# Altium schematic sheet LP_ECG_Main-X01.SchDoc: MCU + BLE
size Letter; Author: C. DEMOLDER; CompanyName: GTBID; DrawnBy: C. DEMOLDER; Engineer: C. DEMOLDER; Organization: GEORGIA TECH; Address1: NORTH AVE NW; Address2: ATLANTA, GA, 30332; DocumentNumber: P001; Revision: X01; SheetNumber: 1; SheetTotal: 4
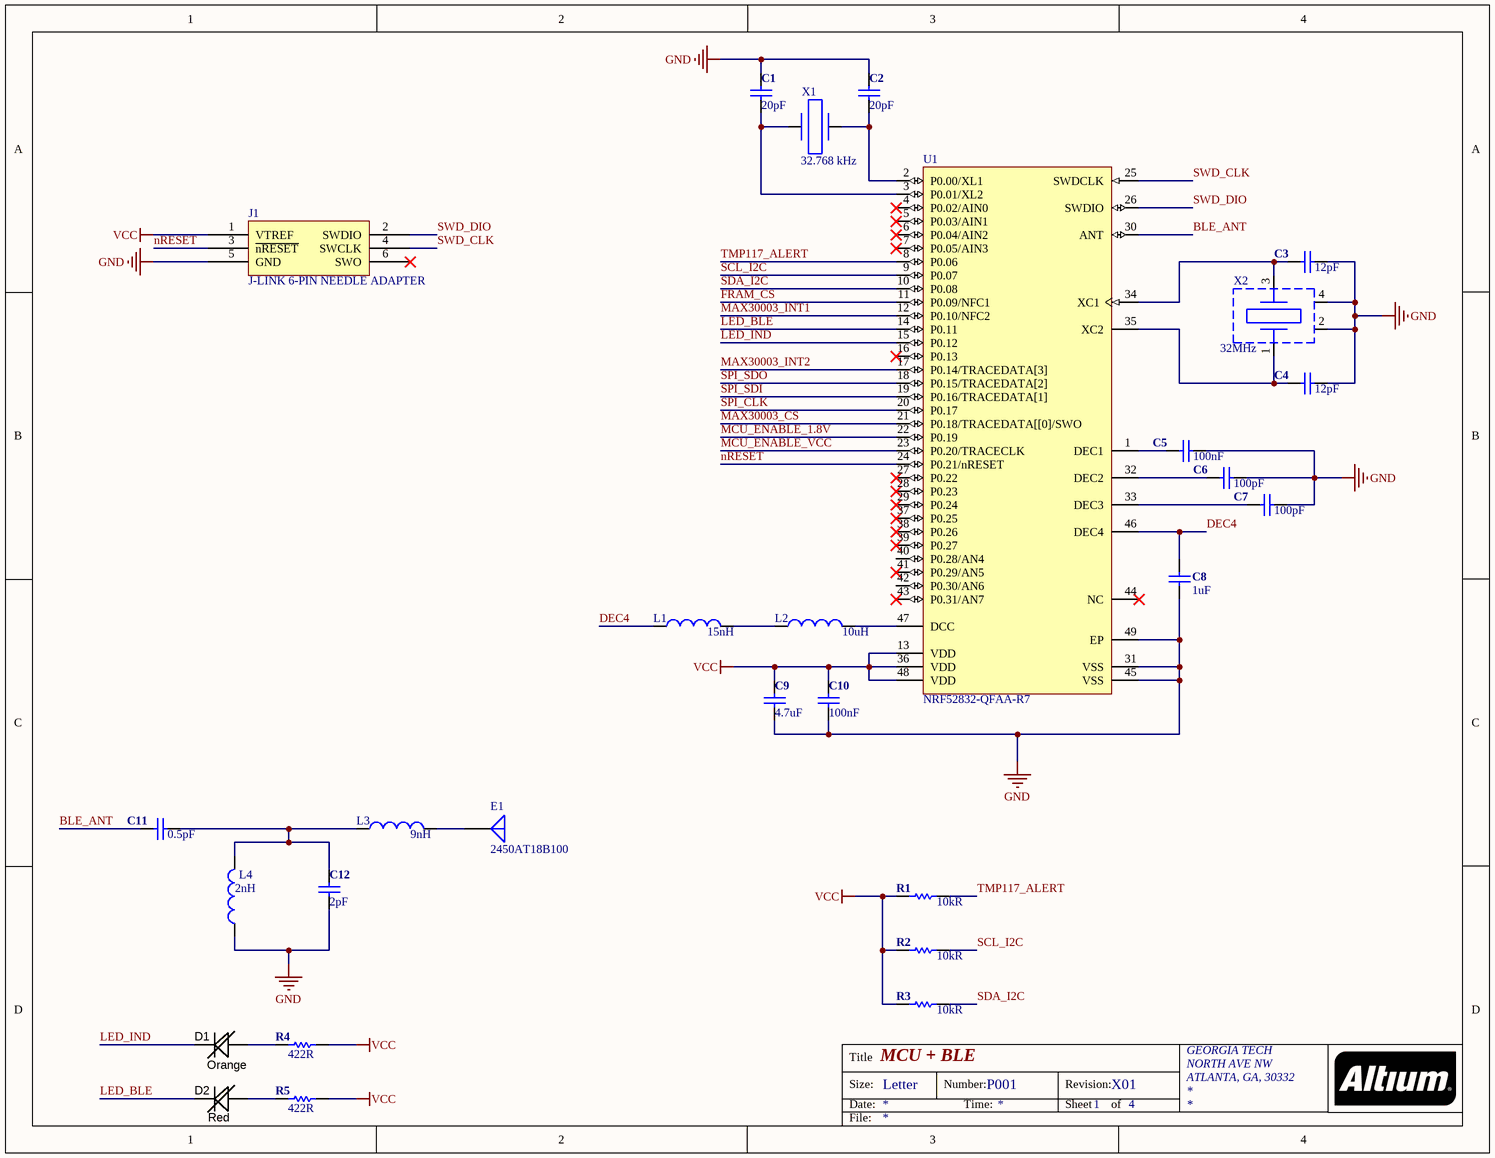
[diagram p0: LP_ECG_Main-X01.SchDoc]

## Parts
C1  20pF  [C0402]
C2  20pF  [C0402]
C3  12pF  [C0402]
C4  12pF  [C0402]
C5  100nF  [C0402]
C6  100pF  [C0402]
C7  100pF  [C0402]
C8  1uF  [C0402]
C9  4.7uF  [C0402]
C10  100nF  [C0402]
C11  0.5pF  [C0402]
C12  2pF  [C0402]
D1  Orange  [LED_0402]
D2  Red  [LED_0402]
E1  2450AT18B100  [2450AT18B100]
J1  J-LINK 6-PIN NEEDLE ADAPTER  [J-LINK 6 PIN NEEDLE]
L1  15nH  [L0402]
L2  10uH  [L0603]
L3  9nH  [L0402]
L4  2nH  [L0402]
R1  10kR  [R0402]
R2  10kR  [R0402]
R3  10kR  [R0402]
R4  422R  [R0402]
R5  422R  [R0402]
U1  NRF52832-QFAA-R7  [NRF52832-QFAA-R7]
X1  32.768 kHz  [CRYSTAL_1MM2_X_1MM0]
X2  32MHz  [CRYSTAL_1MM6_X_1MM2]

## Nets
GND: C1.1 C2.1 C3.2 C4.2 C5.2 C6.2 C7.2 C8.1 C9.2 C10.2 C12.2 J1.5(GND) L4.1 U1.31(VSS) U1.45(VSS) U1.49(EP) X2.2(GND) X2.4(GND)
VCC: C9.1 C10.1 J1.1(VTREF) R1.1 R2.1 R3.1 R4.1 R5.1 U1.13(VDD) U1.36(VDD) U1.48(VDD)
BLE_ANT: C11.1 U1.30(ANT)
DEC4: C8.2 L1.1 U1.46(DEC4)
FRAM_CS: U1.11(P0.09/NFC1)
LED_BLE: D2.K U1.14(P0.11)
LED_IND: D1.K U1.15(P0.12)
MAX30003_CS: U1.21(P0.18/TRACEDATA[[0]/SWO)
MAX30003_INT1: U1.12(P0.10/NFC2)
MAX30003_INT2: U1.17(P0.14/TRACEDATA[3])
MCU_ENABLE_1.8V: U1.22(P0.19)
MCU_ENABLE_VCC: U1.23(P0.20/TRACECLK)
nRESET: J1.3(~{nRESET}) U1.24(P0.21/nRESET)
SCL_I2C: R2.2 U1.9(P0.07)
SDA_I2C: R3.2 U1.10(P0.08)
SPI_CLK: U1.20(P0.17)
SPI_SDI: U1.19(P0.16/TRACEDATA[1])
SPI_SDO: U1.18(P0.15/TRACEDATA[2])
SWD_CLK: J1.4(SWCLK) U1.25(SWDCLK)
SWD_DIO: J1.2(SWDIO) U1.26(SWDIO)
TMP117_ALERT: R1.2 U1.8(P0.06)
NetC1_2: C1.2 U1.3(P0.01/XL2) X1.1
NetC2_2: C2.2 U1.2(P0.00/XL1) X1.2
NetC3_1: C3.1 U1.34(XC1) X2.3
NetC4_1: C4.1 U1.35(XC2) X2.1
NetC5_1: C5.1 U1.1(DEC1)
NetC6_1: C6.1 U1.32(DEC2)
NetC7_1: C7.1 U1.33(DEC3)
NetC11_2: C11.2 C12.1 L3.1 L4.2
NetD1_A: D1.A R4.2
NetD2_A: D2.A R5.2
NetE1_1: E1.1(A) L3.2
NetL1_2: L1.2 L2.1
NetL2_2: L2.2 U1.47(DCC)

Not connected (* = marked no-connect by the designer): J1 6(SWO)*; U1 4(P0.02/AIN0)* 5(P0.03/AIN1)* 6(P0.04/AIN2)* 7(P0.05/AIN3)* 16(P0.13)* 27(P0.22)* 28(P0.23)* 29(P0.24)* 37(P0.25)* 38(P0.26)* 39(P0.27)* 40(P0.28/AN4) 41(P0.29/AN5)* 42(P0.30/AN6) 43(P0.31/AN7)* 44(NC)*

## Notes on the sheet
- Title
- Size:
- Date:
- Letter
- Number:
- Time:
- Revision:
- Sheet
- of
- File:

## Library data of the parts
C1 C2 = C-0402(1005): Ceramic Capacitor, Multilayer, Ceramic, 50V, 1% +Tol, 1% -Tol, C0G, -/+30ppm/Cel TC, 0.00002uF, Surface Mount, 0402; Manufacturer: Murata; Manufacturer Part Number: GJM1555C1H200FB01D; Multilayer: Yes; Supplier 1: Digi-Key; Supplier Part Number 1: 490-11204-1-ND; RoHS: Yes; Category: Ceramic Capacitors; Stock 1: 136231; Pricing 1: 1=0.22000, 10=0.15200, 50=0.09140, 100=0.07710, 500=0.05278, 1000=0.04669, 2500=0.04466, 5000=0.04060 (USD); Mount: Surface Mount; Number of Pins: 2; Dielectric Material: Ceramic; Package Shape: Rectangular; Size Code: 0402; Terminal Finish: Nickel; Min Operating Temperature: -55°C; Max Operating Temperature: 125°C; JESD-609 Code: e3; Capacitance: 20pF; Capacitor Type: Ceramic; Negative Tolerance: 1%; Packaging: Tape and Reel; Positive Tolerance: 1%; Rated DC Voltage (URdc): 50V; Temperature Characteristics Code: C0G; Termination: Wraparound; ComponentLink1URL: https://datasheet.ciiva.com:443/pdfs/VipMasterIC/IC/MURE/MURE-S-A0004378008/MURE-S-A0004383710-1.pdf?src-supplier=IHS+Markit; ComponentLink1Description: https://datasheet.ciiva.com:443/pdfs/VipMasterIC/IC/MURE/MURE-S-A0004378008/MURE-S-A0004383710-1.pdf?src-supplier=IHS+Markit; ComponentLink2URL: http://www.farnell.com/datasheets/2867762.pdf?src-supplier=Farnell; ComponentLink2Description: http://www.farnell.com/datasheets/2867762.pdf?src-supplier=Farnell; ComponentLink3URL: http://www.mouser.com/ds/2/281/c02e-2905.pdf?src-supplier=Mouser; ComponentLink3Description: http://www.mouser.com/ds/2/281/c02e-2905.pdf?src-supplier=Mouser; ComponentLink4URL: http://www.murata.com/products/catalog/pdf/c02e.pdf?src-supplier=Avnet; ComponentLink4Description: http://www.murata.com/products/catalog/pdf/c02e.pdf?src-supplier=Avnet; ComponentLink5URL: http://www.farnell.com/datasheets/2867762.pdf?src-supplier=Newark; ComponentLink5Description: http://www.farnell.com/datasheets/2867762.pdf?src-supplier=Newark; ComponentLink6URL: http://www.farnell.com/datasheets/2867762.pdf?src-supplier=Element14; ComponentLink6Description: http://www.farnell.com/datasheets/2867762.pdf?src-supplier=Element14; ComponentLink7URL: http://search.murata.co.jp/Ceramy/image/img/A01X/G101/ENG/GJM1555C1H200FB01-01.pdf?src-supplier=Digi-Key; ComponentLink7Description: http://search.murata.co.jp/Ceramy/image/img/A01X/G101/ENG/GJM1555C1H200FB01-01.pdf?src-supplier=Digi-Key
C3 C4 = C-0402(1005): Ceramic Capacitor, Multilayer, Ceramic, 50V, 1% +Tol, 1% -Tol, C0G, 30ppm/Cel TC, 0.000012uF, Surface Mount, 0402; Manufacturer: Kyocera AVX; Manufacturer Part Number: 04025U120FAT2A; ComponentLink1URL: https://datasheet.ciiva.com/169/product-169683.pdf; ComponentLink1Description: https://datasheet.ciiva.com/169/product-169683.pdf; Supplier 1: Digi-Key; Supplier Part Number 1: 478-10136-1-ND; RoHS: Yes; Category: Ceramic Capacitors; Stock 1: 30880; Pricing 1: 1=0.33000, 10=0.22700, 100=0.13630, 500=0.10220, 1000=0.08630, 2500=0.08176, 5000=0.07721 (USD); Mount: Surface Mount; Case/Package: 0402; Weight: 2.3E-05oz; Case Code (Metric): 1005; Case Code (Imperial): 0402; Min Operating Temperature: -55°C; Max Operating Temperature: 125°C; Termination: SMD/SMT; Composition: Ceramic; Tolerance: 1%; Packaging: Tape and Reel; Package Quantity: 10000; Capacitance: 12pF; Voltage Rating: 50V; Voltage Rating (DC): 50V; Dielectric: C0G; Length: 1mm; Height: 0.02mm; Thickness: 0.022inch; Depth: 0.5mm; Width: 0.02inch; Radiation Hardening: No; Lead Free: Lead Free; ComponentLink2URL: https://datasheet.ciiva.com:443/pdfs/VipMasterIC/IC/AVXC/AVXC-S-A0008668660/AVXC-S-A0008668660-1.pdf?src-supplier=IHS+Markit; ComponentLink2Description: https://datasheet.ciiva.com:443/pdfs/VipMasterIC/IC/AVXC/AVXC-S-A0008668660/AVXC-S-A0008668660-1.pdf?src-supplier=IHS+Markit; ComponentLink3URL: https://datasheet.ciiva.com/16327/useries-16327642.pdf?src-supplier=Future+Electronics; ComponentLink3Description: https://datasheet.ciiva.com/16327/useries-16327642.pdf?src-supplier=Future+Electronics; ComponentLink4URL: https://datasheet.ciiva.com/11568/useries-11568940.pdf?src-supplier=Avnet; ComponentLink4Description: https://datasheet.ciiva.com/11568/useries-11568940.pdf?src-supplier=Avnet
C5 = C-0402(1005): Ceramic Capacitor, Multilayer, Ceramic, 25V, 10% +Tol, 10% -Tol, X5R, 15% TC, 0.1uF, Surface Mount, 0402; Manufacturer: Taiyo Yuden; Manufacturer Part Number: TMK105BJ104KV-F; ComponentLink1URL: https://datasheet.ciiva.com/169/product-169683.pdf; ComponentLink1Description: https://datasheet.ciiva.com/169/product-169683.pdf; Supplier 1: Digi-Key; Supplier Part Number 1: 587-1456-1-ND; RoHS: Yes; Category: Ceramic Capacitors; Stock 1: 27456801; Pricing 1: 1=0.10000, 10=0.04600, 100=0.02050, 500=0.01464, 1000=0.01150, 2500=0.01045, 5000=0.00961 (USD); Mount: Surface Mount; Case/Package: 0402; Number of Pins: 2; Weight: 2.3E-05oz; Case Code (Imperial): 0402; Case Code (Metric): 1005; Min Operating Temperature: -55°C; Max Operating Temperature: 85°C; Capacitance: 100nF; Tolerance: 10%; Packaging: Tape and Reel; Dielectric: X5R; Voltage Rating (DC): 25V; Voltage Rating: 25V; Package Quantity: 1; Termination: SMD/SMT; Composition: Ceramic; Voltage: 25V; Length: 1mm; Height: 0.5mm; Width: 0.5mm; Depth: 0.5mm; Thickness: 0.022inch; REACH SVHC: No SVHC; Lead Free: Lead Free; Halogen Free: Halogen Free; ComponentLink2URL: https://datasheet.ciiva.com:443/pdfs/VipMasterIC/IC/TAIY/TAIY-S-A0009103435/TAIY-S-A0009103038-1.pdf?src-supplier=IHS+Markit; ComponentLink2Description: https://datasheet.ciiva.com:443/pdfs/VipMasterIC/IC/TAIY/TAIY-S-A0009103435/TAIY-S-A0009103038-1.pdf?src-supplier=IHS+Markit; ComponentLink3URL: https://datasheet.ciiva.com/30051/25tmk105bj104kv-f-30051094.pdf?src-supplier=Onlinecomponents.com; ComponentLink3Description: https://datasheet.ciiva.com/30051/25tmk105bj104kv-f-30051094.pdf?src-supplier=Onlinecomponents.com; ComponentLink4URL: https://datasheet.ciiva.com/15922/28tmk105bj104kv-f-15922315.pdf?src-supplier=Onlinecomponents.com; ComponentLink4Description: https://datasheet.ciiva.com/15922/28tmk105bj104kv-f-15922315.pdf?src-supplier=Onlinecomponents.com; ComponentLink5URL: https://datasheet.ciiva.com/131/tmk105bj104kv-f-ss-131420.pdf?src-supplier=Digi-Key; ComponentLink5Description: https://datasheet.ciiva.com/131/tmk105bj104kv-f-ss-131420.pdf?src-supplier=Digi-Key; ComponentLink6URL: https://datasheet.ciiva.com/22768/1693457-22768649.pdf?src-supplier=Farnell; ComponentLink6Description: https://datasheet.ciiva.com/22768/1693457-22768649.pdf?src-supplier=Farnell
C6 C7 = C-0402(1005): Ceramic Capacitor, Multilayer, Ceramic, 50V, 1% +Tol, 1% -Tol, C0G, 30ppm/Cel TC, 0.0001uF, Surface Mount, 0402; Manufacturer: Yageo; Manufacturer Part Number: CC0402FRNPO9BN101; ComponentLink1URL: https://datasheet.ciiva.com/169/product-169683.pdf; ComponentLink1Description: https://datasheet.ciiva.com/169/product-169683.pdf; Supplier 1: Digi-Key; Supplier Part Number 1: 311-3329-1-ND; RoHS: Yes; Category: Ceramic Capacitors; Stock 1: 22812; Pricing 1: 1=0.11000, 10=0.08200, 100=0.03840, 500=0.02690, 1000=0.02228, 2500=0.02073, 5000=0.01897 (USD); Mount: Surface Mount; Case/Package: 0402; Case Code (Imperial): 0402; Case Code (Metric): 1005; Min Operating Temperature: -55°C; Max Operating Temperature: 125°C; Package Quantity: 10000; Voltage Rating (DC): 50V; Dielectric: C0G; Termination: SMD/SMT; Composition: Ceramic; Packaging: Tape and Reel; Capacitance: 100pF; Tolerance: 1%; Voltage Rating: 50V; Length: 1mm; Width: 0.02inch; Thickness: 0.022inch; Depth: 0.5mm; Lead Free: Lead Free; ComponentLink2URL: https://datasheet.ciiva.com:443/pdfs/VipMasterIC/IC/YAGO/YAGO-S-A0009251638/YAGO-S-A0009251638-1.pdf?src-supplier=IHS+Markit; ComponentLink2Description: https://datasheet.ciiva.com:443/pdfs/VipMasterIC/IC/YAGO/YAGO-S-A0009251638/YAGO-S-A0009251638-1.pdf?src-supplier=IHS+Markit; ComponentLink3URL: http://www.mouser.com/ds/2/447/Yageo_UPY-GP_NP0_16V-to-50V_9-358835.pdf?src-supplier=Mouser; ComponentLink3Description: http://www.mouser.com/ds/2/447/Yageo_UPY-GP_NP0_16V-to-50V_9-358835.pdf?src-supplier=Mouser; ComponentLink4URL: http://components.arrow.com/part/dataview/0323_00775990?src-supplier=Arrow+Europe; ComponentLink4Description: http://components.arrow.com/part/dataview/0323_00775990?src-supplier=Arrow+Europe; ComponentLink5URL: http://www.yageo.com/NewPortal/yageodocoutput?fileName=/pdf/MLCC/UPY-GP_NP0_16V-to-50V_14.pdf&src-supplier=Digi-Key; ComponentLink5Description: http://www.yageo.com/NewPortal/yageodocoutput?fileName=/pdf/MLCC/UPY-GP_NP0_16V-to-50V_14.pdf&src-supplier=Digi-Key; ComponentLink6URL: http://www.yageo.com/documents/recent/UPY-GP_NP0_16V-to-50V_16.pdf?src-supplier=Digi-Key; ComponentLink6Description: http://www.yageo.com/documents/recent/UPY-GP_NP0_16V-to-50V_16.pdf?src-supplier=Digi-Key; ComponentLink7URL: http://www.yageo.com/documents/recent/UPY-GP_NP0_16V-to-50V_9.pdf?src-supplier=Future+Electronics; ComponentLink7Description: http://www.yageo.com/documents/recent/UPY-GP_NP0_16V-to-50V_9.pdf?src-supplier=Future+Electronics
C8 = C-0402(1005): Ceramic Capacitor, Multilayer, Ceramic, 6.3V, 20% +Tol, 20% -Tol, X5R, 15% TC, 1uF, Surface Mount, 0402; Manufacturer: Yageo; Manufacturer Part Number: CC0402MRX5R5BB105; Dissipation Factor: 10%; ComponentLink1URL: https://datasheet.ciiva.com/169/product-169683.pdf; ComponentLink1Description: https://datasheet.ciiva.com/169/product-169683.pdf; Supplier 1: Digi-Key; Supplier Part Number 1: 311-1441-1-ND; RoHS: Yes; Category: Ceramic Capacitors; Stock 1: 16697; Pricing 1: 1=0.13000, 10=0.08900, 100=0.04200, 500=0.02946, 1000=0.02439, 2500=0.02270, 5000=0.02076 (USD); Mount: Surface Mount; Case/Package: 0402; Number of Pins: 2; Case Code (Imperial): 0402; Case Code (Metric): 1005; Min Operating Temperature: -55°C; Max Operating Temperature: 85°C; Capacitance: 1uF; Tolerance: 20%; Voltage Rating: 6.3V; Voltage Rating (DC): 6.3V; Packaging: Tape and Reel; Package Quantity: 1; Dielectric: X5R; Termination: SMD/SMT; Composition: Ceramic; Length: 1mm; Height: 0.5mm; Width: 0.5mm; Thickness: 0.022inch; Depth: 0.5mm; Lead Free: Lead Free; Halogen Free: Halogen Free; ComponentLink2URL: https://datasheet.ciiva.com:443/pdfs/VipMasterIC/IC/YAGO/YAGO-S-A0006851646/YAGO-S-A0006851646-1.pdf?src-supplier=IHS+Markit; ComponentLink2Description: https://datasheet.ciiva.com:443/pdfs/VipMasterIC/IC/YAGO/YAGO-S-A0006851646/YAGO-S-A0006851646-1.pdf?src-supplier=IHS+Markit; ComponentLink3URL: https://datasheet.ciiva.com/176/mlccorderingcode-176806.pdf?src-supplier=Digi-Key; ComponentLink3Description: https://datasheet.ciiva.com/176/mlccorderingcode-176806.pdf?src-supplier=Digi-Key; ComponentLink4URL: https://datasheet.ciiva.com/176/mlccorderingcode-176807.pdf?src-supplier=Digi-Key; ComponentLink4Description: https://datasheet.ciiva.com/176/mlccorderingcode-176807.pdf?src-supplier=Digi-Key; ComponentLink5URL: https://datasheet.ciiva.com/176/mlccorderingcode-176808.pdf?src-supplier=Digi-Key; ComponentLink5Description: https://datasheet.ciiva.com/176/mlccorderingcode-176808.pdf?src-supplier=Digi-Key
C9 = C-0402(1005): Ceramic Capacitor, Multilayer, Ceramic, 6.3V, 20% +Tol, 20% -Tol, X5R, 15% TC, 4.7uF, Surface Mount, 0402; Manufacturer: Murata; Manufacturer Part Number: GRM155R60J475ME87J; Multilayer: Yes; Supplier 1: Digi-Key; Supplier Part Number 1: 490-18211-1-ND; RoHS: No; Category: Ceramic Capacitors; Stock 1: 23345; Pricing 1: 1=0.14000, 10=0.10100, 50=0.05720, 100=0.04740, 500=0.03322, 1000=0.02750, 2500=0.02559, 5000=0.02341 (USD); Mount: Surface Mount; Number of Pins: 2; Package Shape: Rectangular; Size Code: 0402; Terminal Finish: Nickel; Dielectric Material: Ceramic; Min Operating Temperature: -55°C; Max Operating Temperature: 85°C; Package Style: SMTMeter; Packaging: Tape and Reel; Positive Tolerance: 20%; Rated DC Voltage (URdc): 6.3V; Temperature Characteristics Code: X5R; Termination: Wraparound; JESD-609 Code: e3; Capacitance: 4.7uF; Capacitor Type: Ceramic; Negative Tolerance: 20%; Length: 1mm; Width: 0.5mm; Height: 0.5mm; ComponentLink1URL: https://datasheet.ciiva.com:443/pdfs/VipMasterIC/IC/MURE/MURE-S-A0004362469/MURE-S-A0004364141-1.pdf?src-supplier=IHS+Markit; ComponentLink1Description: https://datasheet.ciiva.com:443/pdfs/VipMasterIC/IC/MURE/MURE-S-A0004362469/MURE-S-A0004364141-1.pdf?src-supplier=IHS+Markit; ComponentLink2URL: https://search.murata.co.jp/Ceramy/image/img/A01X/G101/ENG/GRM155R60J475ME87-01.pdf?src-supplier=Digi-Key; ComponentLink2Description: https://search.murata.co.jp/Ceramy/image/img/A01X/G101/ENG/GRM155R60J475ME87-01.pdf?src-supplier=Digi-Key
C10 = C-0402(1005): Ceramic Capacitor, Multilayer, Ceramic, 25V, 10% +Tol, 10% -Tol, X5R, 15% TC, 0.1uF, Surface Mount, 0402; Manufacturer: Taiyo Yuden; Manufacturer Part Number: TMK105BJ104KV-F; Multilayer: Yes; ComponentLink1URL: https://datasheet.ciiva.com/169/product-169683.pdf; ComponentLink1Description: https://datasheet.ciiva.com/169/product-169683.pdf; Supplier 1: Digi-Key; Supplier Part Number 1: 587-1456-1-ND; RoHS: Yes; Category: Ceramic Capacitors; Stock 1: 17621987; Pricing 1: 1=0.10000, 10=0.04000, 50=0.02180, 100=0.01780, 500=0.01270, 1000=0.00998, 2500=0.00908, 5000=0.00835 (USD); Mount: Surface Mount; Number of Pins: 2; Dielectric Material: Ceramic; Package Shape: Rectangular; Size Code: 0402; Terminal Finish: Nickel; Min Operating Temperature: -55°C; Max Operating Temperature: 85°C; JESD-609 Code: e3; Capacitance: 100nF; Capacitor Type: Ceramic; Negative Tolerance: 10%; Package Style: SMTMeter; Packaging: Tape and Reel; Positive Tolerance: 10%; Rated DC Voltage (URdc): 25V; Temperature Characteristics Code: X5R; Termination: Wraparound; Length: 1mm; Width: 0.5mm; Height: 0.5mm; ComponentLink2URL: https://datasheet.ciiva.com:443/pdfs/VipMasterIC/IC/TAIY/TAIY-S-A0009103435/TAIY-S-A0009103038-1.pdf?src-supplier=IHS+Markit; ComponentLink2Description: https://datasheet.ciiva.com:443/pdfs/VipMasterIC/IC/TAIY/TAIY-S-A0009103435/TAIY-S-A0009103038-1.pdf?src-supplier=IHS+Markit; ComponentLink3URL: https://datasheet.ciiva.com/30051/25tmk105bj104kv-f-30051094.pdf?src-supplier=Onlinecomponents.com; ComponentLink3Description: https://datasheet.ciiva.com/30051/25tmk105bj104kv-f-30051094.pdf?src-supplier=Onlinecomponents.com; ComponentLink4URL: https://datasheet.ciiva.com/15922/28tmk105bj104kv-f-15922315.pdf?src-supplier=Onlinecomponents.com; ComponentLink4Description: https://datasheet.ciiva.com/15922/28tmk105bj104kv-f-15922315.pdf?src-supplier=Onlinecomponents.com; ComponentLink5URL: https://datasheet.ciiva.com/131/tmk105bj104kv-f-ss-131420.pdf?src-supplier=Digi-Key; ComponentLink5Description: https://datasheet.ciiva.com/131/tmk105bj104kv-f-ss-131420.pdf?src-supplier=Digi-Key; ComponentLink6URL: https://datasheet.ciiva.com/22768/1693457-22768649.pdf?src-supplier=Farnell; ComponentLink6Description: https://datasheet.ciiva.com/22768/1693457-22768649.pdf?src-supplier=Farnell
C11 = C-0402(1005): Ceramic Capacitor, Multilayer, Ceramic, 50V, 10% +Tol, 10% -Tol, C0G, 30ppm/Cel TC, 0.0000005uF, Surface Mount, 0402; Manufacturer: Murata; Manufacturer Part Number: GJM1555C1HR50WB01D; ComponentLink1URL: https://datasheet.ciiva.com/169/product-169683.pdf; ComponentLink1Description: https://datasheet.ciiva.com/169/product-169683.pdf; Supplier 1: Digi-Key; Supplier Part Number 1: 490-11250-1-ND; RoHS: Yes; Category: Ceramic Capacitors; Stock 1: 75988; Pricing 1: 1=0.30000, 10=0.20500, 100=0.11610, 500=0.08198, 1000=0.07173, 2500=0.06831, 5000=0.06319 (USD); Mount: Surface Mount; Case/Package: 0402; Case Code (Metric): 1005; Case Code (Imperial): 0402; Min Operating Temperature: -55°C; Max Operating Temperature: 125°C; Package Quantity: 10000; Capacitance: 0.5pF; Voltage Rating: 50V; Packaging: Tape and Reel; Voltage Rating (DC): 50V; Dielectric: C0G; Termination: SMD/SMT; Voltage: 50V; Length: 1mm; Height: 0.5mm; Width: 0.02inch; Thickness: 0.022inch; Depth: 0.5mm; Radiation Hardening: No; Lead Free: Lead Free; ComponentLink2URL: https://datasheet.ciiva.com:443/pdfs/VipMasterIC/IC/MURE/MURE-S-A0004378008/MURE-S-A0004383131-1.pdf?src-supplier=IHS+Markit; ComponentLink2Description: https://datasheet.ciiva.com:443/pdfs/VipMasterIC/IC/MURE/MURE-S-A0004378008/MURE-S-A0004383131-1.pdf?src-supplier=IHS+Markit; ComponentLink3URL: https://datasheet.ciiva.com/169/product-169683.pdf?src-supplier=Digi-Key; ComponentLink3Description: https://datasheet.ciiva.com/169/product-169683.pdf?src-supplier=Digi-Key
C12 = C-0402(1005): Ceramic Capacitor, Multilayer, Ceramic, 50V, 5% +Tol, 5% -Tol, C0G, 30ppm/Cel TC, 0.000002uF, Surface Mount, 0402; Manufacturer: Murata; Manufacturer Part Number: GJM1555C1H2R0BB01D; ComponentLink1URL: https://datasheet.ciiva.com/169/product-169683.pdf; ComponentLink1Description: https://datasheet.ciiva.com/169/product-169683.pdf; Supplier 1: Digi-Key; Supplier Part Number 1: 490-8091-1-ND; RoHS: Yes; Category: Ceramic Capacitors; Stock 1: 969; Pricing 1: 1=0.19000, 10=0.13000, 100=0.06590, 500=0.04508, 1000=0.03987, 2500=0.03814, 5000=0.03467 (USD); Mount: Surface Mount; Case/Package: 0402; Number of Pins: 2; Case Code (Metric): 1005; Case Code (Imperial): 0402; Min Operating Temperature: -55°C; Max Operating Temperature: 125°C; Package Quantity: 1; Packaging: Tape and Reel; Capacitance: 2pF; Voltage Rating: 50V; Voltage Rating (DC): 50V; Dielectric: C0G; Termination: SMD/SMT; Length: 1mm; Height: 0.5mm; Width: 0.5mm; Thickness: 0.022inch; Lead Pitch: 0.3mm; Depth: 0.5mm; Radiation Hardening: No; REACH SVHC: No SVHC; Lead Free: Lead Free; ComponentLink2URL: https://datasheet.ciiva.com:443/pdfs/VipMasterIC/IC/MURE/MURE-S-A0008911154/MURE-S-A0008911197-1.pdf?src-supplier=IHS+Markit; ComponentLink2Description: https://datasheet.ciiva.com:443/pdfs/VipMasterIC/IC/MURE/MURE-S-A0008911154/MURE-S-A0008911197-1.pdf?src-supplier=IHS+Markit; ComponentLink3URL: https://datasheet.ciiva.com/5694/1700193-5694978.pdf?src-supplier=Farnell; ComponentLink3Description: https://datasheet.ciiva.com/5694/1700193-5694978.pdf?src-supplier=Farnell; ComponentLink4URL: https://datasheet.ciiva.com/17453/product-17453487.pdf?src-supplier=Avnet+Europe; ComponentLink4Description: https://datasheet.ciiva.com/17453/product-17453487.pdf?src-supplier=Avnet+Europe; ComponentLink5URL: https://datasheet.ciiva.com/16440/l0005e-16440476.pdf?src-supplier=Future+Electronics; ComponentLink5Description: https://datasheet.ciiva.com/16440/l0005e-16440476.pdf?src-supplier=Future+Electronics
D1 = LED_0402(1005): Single Color LED, Super Bright Orange, Water Clear, 0.8mm; Manufacturer: Kingbright; Manufacturer Part Number: APHHS1005SECK; Number of LEDs: 1; Dominant Wavelength: 601nm; Test Current: 20mA; Viewing Angle: 120°; Lens Style: Clear,Flat; Luminous Intensity: 240mcd; Forward Voltage: 2.1V; Supplier 1: Digi-Key; Supplier Part Number 1: 754-1103-1-ND; RoHS: Yes; Category: LEDs; Stock 1: 18062; Pricing 1: 1=0.50000, 10=0.35400, 100=0.20650, 500=0.14160, 1000=0.11800 (USD); Mount: Surface Mount; Case/Package: 0402; Number of Pins: 2; Lens Color: Clear; Color: Orange; Case Code (Imperial): 0402; Case Code (Metric): 1005; Min Operating Temperature: -40°C; Max Operating Temperature: 85°C; Package Quantity: 2000; Packaging: Tape and Reel; Wavelength: 601nm; Illumination Color: Orange; Forward Current: 20mA; Length: 1mm; Height: 0.6mm; Width: 0.5mm; Lead Free: Lead Free; ComponentLink1URL: https://datasheet.ciiva.com:443/pdfs/VipMasterIC/IC/KNGB/KNGBS06640/KNGBS06640-1.pdf?src-supplier=IHS+Markit; ComponentLink1Description: https://datasheet.ciiva.com:443/pdfs/VipMasterIC/IC/KNGB/KNGBS06640/KNGBS06640-1.pdf?src-supplier=IHS+Markit; ComponentLink2URL: https://datasheet.ciiva.com/2114/aphhs1005seck-2114149.pdf?src-supplier=Digi-Key; ComponentLink2Description: https://datasheet.ciiva.com/2114/aphhs1005seck-2114149.pdf?src-supplier=Digi-Key; ComponentLink3URL: https://datasheet.ciiva.com/4688/aphhs1005seck-36485-4688716.pdf?src-supplier=Mouser; ComponentLink3Description: https://datasheet.ciiva.com/4688/aphhs1005seck-36485-4688716.pdf?src-supplier=Mouser; ComponentLink4URL: https://datasheet.ciiva.com/2114/aphhs1005seck-2114150.pdf?src-supplier=Digi-Key; ComponentLink4Description: https://datasheet.ciiva.com/2114/aphhs1005seck-2114150.pdf?src-supplier=Digi-Key; ComponentLink5URL: https://datasheet.ciiva.com/2114/aphhs1005seck-2114151.pdf?src-supplier=Digi-Key; ComponentLink5Description: https://datasheet.ciiva.com/2114/aphhs1005seck-2114151.pdf?src-supplier=Digi-Key; ComponentLink6URL: https://datasheet.ciiva.com/16412/aphhs1005seck-16412186.pdf?src-supplier=Future+Electronics; ComponentLink6Description: https://datasheet.ciiva.com/16412/aphhs1005seck-16412186.pdf?src-supplier=Future+Electronics
D2 = LED_0402(1005): Single Color LED, Hyper Red, Water Clear, 0.8mm; Manufacturer: Kingbright; Manufacturer Part Number: APHHS1005SURCK; Forward Current: 20mA; Forward Voltage: 1.95V; Luminous Intensity: 220mcd; Viewing Angle: 120°; Wavelength: 635nm; Lens Style: Clear,Flat; Dominant Wavelength: 630nm; Number of LEDs: 1; Supplier 1: Digi-Key; Supplier Part Number 1: 754-1104-1-ND; RoHS: Yes; Category: LEDs; Stock 1: 12156; Pricing 1: 1=0.50000, 10=0.35400, 100=0.20650, 500=0.14160, 1000=0.11800 (USD); Mount: Surface Mount; Case/Package: 0402; Number of Pins: 2; Color: Red; Case Code (Metric): 1005; Case Code (Imperial): 0402; Lens Color: Clear; Min Operating Temperature: -40°C; Max Operating Temperature: 85°C; Packaging: Tape and Reel; Package Quantity: 2000; Illumination Color: Red; Test Current: 20mA; Length: 1mm; Height: 0.6mm; Width: 0.5mm; Lead Free: Lead Free; ComponentLink1URL: https://datasheet.ciiva.com:443/pdfs/VipMasterIC/IC/KBEC/KBEC-S-A0008947180/KBEC-S-A0008958151-1.pdf?src-supplier=IHS+Markit; ComponentLink1Description: https://datasheet.ciiva.com:443/pdfs/VipMasterIC/IC/KBEC/KBEC-S-A0008947180/KBEC-S-A0008958151-1.pdf?src-supplier=IHS+Markit; ComponentLink2URL: https://datasheet.ciiva.com/4689/aphhs1005surck-32322-4689068.pdf?src-supplier=Mouser; ComponentLink2Description: https://datasheet.ciiva.com/4689/aphhs1005surck-32322-4689068.pdf?src-supplier=Mouser; ComponentLink3URL: https://datasheet.ciiva.com/2114/aphhs1005surck-2114140.pdf?src-supplier=Digi-Key; ComponentLink3Description: https://datasheet.ciiva.com/2114/aphhs1005surck-2114140.pdf?src-supplier=Digi-Key; ComponentLink4URL: https://datasheet.ciiva.com/14603/70062833-14603899.pdf?src-supplier=Allied+Electronics; ComponentLink4Description: https://datasheet.ciiva.com/14603/70062833-14603899.pdf?src-supplier=Allied+Electronics; ComponentLink5URL: https://datasheet.ciiva.com/2114/aphhs1005surck-2114142.pdf?src-supplier=Digi-Key; ComponentLink5Description: https://datasheet.ciiva.com/2114/aphhs1005surck-2114142.pdf?src-supplier=Digi-Key; ComponentLink6URL: https://datasheet.ciiva.com/2114/aphhs1005surck-2114141.pdf?src-supplier=Digi-Key; ComponentLink6Description: https://datasheet.ciiva.com/2114/aphhs1005surck-2114141.pdf?src-supplier=Digi-Key
E1 = 2450AT18B100: RF/Microwave Antenna, 2400MHz Min, 2500MHz Max; Manufacturer: Johanson; Manufacturer Part Number: 2450AT18B100E; Characteristic Impedance: 50R; Operating Frequency-Max: 2.5MHz; Operating Frequency-Min: 2.4MHz; RF/Microwave Device Type: ANTENNA-OTHER; Supplier 1: Digi-Key; Supplier Part Number 1: 712-1006-1-ND; RoHS: Yes; Category: RF Antennas; Pricing 1: 1=0.56000, 10=0.49500, 25=0.46520, 100=0.37950, 250=0.35252, 500=0.30000, 1000=0.24000 (USD); Terminal Finish: Tin; Min Operating Temperature: -40°C; Max Operating Temperature: 85°C; JESD-609 Code: e3; Construction: COMPONENT; ComponentLink1URL: https://datasheet.ciiva.com:443/pdfs/VipMasterIC/IC/JOHA/JOHAS00625/JOHAS00625-1.pdf?src-supplier=IHS+Markit; ComponentLink1Description: https://datasheet.ciiva.com:443/pdfs/VipMasterIC/IC/JOHA/JOHAS00625/JOHAS00625-1.pdf?src-supplier=IHS+Markit; ComponentLink2URL: https://datasheet.ciiva.com/24025/antenna-2450at18b100-242422-24025839.pdf?src-supplier=Mouser; ComponentLink2Description: https://datasheet.ciiva.com/24025/antenna-2450at18b100-242422-24025839.pdf?src-supplier=Mouser; ComponentLink3URL: https://datasheet.ciiva.com/1124/1318299-1124918.pdf?src-supplier=Element14; ComponentLink3Description: https://datasheet.ciiva.com/1124/1318299-1124918.pdf?src-supplier=Element14
J1 = J-Link 6 pin needle: Manufacturer: Segger; Manufacturer Part Number: 8.06.16 J-LINK 6-PIN NEEDLE ADAPTER; Supplier 1: Digi-Key; RoHS: No; Stock 1: 177; Pricing 1: 1=104.13000 (USD); Supplier Part Number 1: 899-1051-ND
L1 = I-0402(1005): General Purpose Inductor, 0.015uH, 5%, 1 Element, Ferrite-Core, SMD, 0402; Manufacturer: Taiyo Yuden; Manufacturer Part Number: HK100515NJ-T; Core Material: Ferrite,Ceramic; Body Material: Ceramic; Current Rating: 320mA; Shielding: Unshielded; Self Resonant Frequency: 2.3GHz; Q Factor: 8; DC Resistance (DCR): 460mR; Test Frequency: 100MHz; Max DC Current: 300mA; Supplier 1: Digi-Key; Supplier Part Number 1: 587-1521-1-ND; RoHS: Yes; Category: Fixed Inductors; Stock 1: 127125; Pricing 1: 1=0.10000, 10=0.02900, 100=0.01960, 500=0.01582, 1000=0.01351, 2500=0.01208 (USD); Mount: Surface Mount; Case/Package: 0402; Number of Pins: 2; Case Code (Metric): 1005; Case Code (Imperial): 0402; Min Operating Temperature: -55°C; Max Operating Temperature: 125°C; Packaging: Tape and Reel; Inductance: 15nH; Package Quantity: 10000; Tolerance: 5%; Inductance Tolerance: 5%; Termination: SMD/SMT; DC Current: 320mA; Military Standard: Not; Length: 1.05mm; Height: 0.5mm; Width: 0.02inch; Height - Seated (Max): 0.022inch; Depth: 0.55mm; Radiation Hardening: No; Lead Free: Exempt; Halogen Free: Halogen Free; REACH SVHC: Unknown; ComponentLink1URL: https://datasheet.ciiva.com:443/pdfs/VipMasterIC/IC/TAIY/TAIY-S-A0009098652/TAIY-S-A0009098648-1.pdf?src-supplier=IHS+Markit; ComponentLink1Description: https://datasheet.ciiva.com:443/pdfs/VipMasterIC/IC/TAIY/TAIY-S-A0009098652/TAIY-S-A0009098648-1.pdf?src-supplier=IHS+Markit; ComponentLink2URL: https://datasheet.ciiva.com/6688/hk100515nj-t-ss-6688640.pdf?src-supplier=Digi-Key; ComponentLink2Description: https://datasheet.ciiva.com/6688/hk100515nj-t-ss-6688640.pdf?src-supplier=Digi-Key; ComponentLink3URL: https://datasheet.ciiva.com/8498/hk100515nj-t-ss-8498917.pdf?src-supplier=Avnet; ComponentLink3Description: https://datasheet.ciiva.com/8498/hk100515nj-t-ss-8498917.pdf?src-supplier=Avnet; ComponentLink4URL: https://datasheet.ciiva.com/26871/getdatasheetpartid-645793-26871605.pdf?src-supplier=Verical; ComponentLink4Description: https://datasheet.ciiva.com/26871/getdatasheetpartid-645793-26871605.pdf?src-supplier=Verical; ComponentLink5URL: https://datasheet.ciiva.com/15986/1443hk100515nj-t-15986294.pdf?src-supplier=Onlinecomponents.com; ComponentLink5Description: https://datasheet.ciiva.com/15986/1443hk100515nj-t-15986294.pdf?src-supplier=Onlinecomponents.com; ComponentLink6URL: https://datasheet.ciiva.com/30215/1387hk100515nj-t-30215366.pdf?src-supplier=Onlinecomponents.com; ComponentLink6Description: https://datasheet.ciiva.com/30215/1387hk100515nj-t-30215366.pdf?src-supplier=Onlinecomponents.com
L2 = I-0603(1608): General Purpose Inductor, 10uH, 10%, 1 Element, Ferrite-Core, SMD, 0603; Manufacturer: Taiyo Yuden; Manufacturer Part Number: CBMF1608T100K; DC Resistance (DCR): 468mR; Test Frequency: 2.52MHz; Max DC Current: 380mA; Saturation Current: 115mA; Shielding: Unshielded; Self Resonant Frequency: 32MHz; Supplier 1: Digi-Key; Supplier Part Number 1: 587-1720-1-ND; RoHS: Yes; Category: Fixed Inductors; Stock 1: 148191; Pricing 1: 1=0.27000, 10=0.23900, 100=0.16450, 500=0.14054, 1000=0.10764 (USD); Mount: Surface Mount; Case/Package: 0603; Core Material: Ferrite; Case Code (Metric): 1608; Case Code (Imperial): 0603; Min Operating Temperature: -40°C; Max Operating Temperature: 105°C; Composition: Wirewound; Inductance: 10uH; Termination: SMD/SMT; DC Current: 380mA; Military Standard: Not; Package Quantity: 3000; Current Rating: 380mA; Tolerance: 10%; Packaging: Tape and Reel; Inductance Tolerance: 10%; Length: 0.063inch; Height: 0.8mm; Height - Seated (Max): 0.039inch; Depth: 1mm; Width: 0.031inch; Radiation Hardening: No; REACH SVHC: Unknown; Lead Free: Lead Free; Halogen Free: Halogen Free; ComponentLink1URL: https://datasheet.ciiva.com:443/pdfs/VipMasterIC/IC/TAIY/TAIY-S-A0009098652/TAIY-S-A0009097792-1.pdf?src-supplier=IHS+Markit; ComponentLink1Description: https://datasheet.ciiva.com:443/pdfs/VipMasterIC/IC/TAIY/TAIY-S-A0009098652/TAIY-S-A0009097792-1.pdf?src-supplier=IHS+Markit; ComponentLink2URL: https://datasheet.ciiva.com/1040/cbmf1608t100k-ss-1040608.pdf?src-supplier=Digi-Key; ComponentLink2Description: https://datasheet.ciiva.com/1040/cbmf1608t100k-ss-1040608.pdf?src-supplier=Digi-Key; ComponentLink3URL: https://datasheet.ciiva.com/26871/getdatasheetpartid-638595-26871191.pdf?src-supplier=Verical; ComponentLink3Description: https://datasheet.ciiva.com/26871/getdatasheetpartid-638595-26871191.pdf?src-supplier=Verical; ComponentLink4URL: https://datasheet.ciiva.com/15981/521cbmf1608t100k-15981672.pdf?src-supplier=Onlinecomponents.com; ComponentLink4Description: https://datasheet.ciiva.com/15981/521cbmf1608t100k-15981672.pdf?src-supplier=Onlinecomponents.com; ComponentLink5URL: https://datasheet.ciiva.com/46395/1521599-46395181.pdf?src-supplier=Element14; ComponentLink5Description: https://datasheet.ciiva.com/46395/1521599-46395181.pdf?src-supplier=Element14
L3 = I-0402(1005): General Purpose Inductor, 0.009uH, 2%, 1 Element, SMD; Manufacturer: Murata; Manufacturer Part Number: LQW15AN9N0G80D; Current Rating: 1.42A; Shielding: Unshielded; DC Resistance (DCR): 70mR; Self Resonant Frequency: 6.5GHz; Test Frequency: 100MHz; Supplier 1: Digi-Key; Supplier Part Number 1: 490-14715-1-ND; RoHS: Yes; Category: Fixed Inductors; Stock 1: 10351; Pricing 1: 1=0.25000, 10=0.22100, 100=0.15180, 500=0.12972, 1000=0.09936, 2500=0.09384 (USD); Mount: Surface Mount; Case/Package: 0402; Min Operating Temperature: -55°C; Max Operating Temperature: 125°C; Tolerance: 2%; Packaging: Tape and Reel; Composition: Wirewound; Inductance: 9nH; Length: 0.039inch; Width: 0.024inch; Height - Seated (Max): 0.024inch; ComponentLink1URL: https://datasheet.ciiva.com:443/pdfs/VipMasterIC/IC/MURE/MURE-S-A0004390746/MURE-S-A0004390720-1.pdf?src-supplier=IHS+Markit; ComponentLink1Description: https://datasheet.ciiva.com:443/pdfs/VipMasterIC/IC/MURE/MURE-S-A0004390746/MURE-S-A0004390720-1.pdf?src-supplier=IHS+Markit; ComponentLink2URL: https://search.murata.co.jp/Ceramy/image/img/P02/partnumbering_LQ3E.pdf?src-supplier=Digi-Key; ComponentLink2Description: https://search.murata.co.jp/Ceramy/image/img/P02/partnumbering_LQ3E.pdf?src-supplier=Digi-Key; ComponentLink3URL: https://search.murata.co.jp/Ceramy/image/img/P02/JELF243A-0100.pdf?src-supplier=Digi-Key; ComponentLink3Description: https://search.murata.co.jp/Ceramy/image/img/P02/JELF243A-0100.pdf?src-supplier=Digi-Key
L4 = I-0402(1005): General Purpose Inductor, 0.002uH, 5%, 1 Element, Ceramic-Core, SMD, 0402; Manufacturer: Abracon; Manufacturer Part Number: AISC-0402-2N0J-T; DC Resistance (DCR): 70mR; Test Frequency: 250MHz; Max DC Current: 1.04A; Shielding: Unshielded; Q Factor: 16; Self Resonant Frequency: 11.1GHz; Supplier 1: Digi-Key; Supplier Part Number 1: 535-10424-1-ND; RoHS: Yes; Category: Inductors; Stock 1: 4311; Pricing 1: 1=0.34000, 10=0.30400, 100=0.20870, 500=0.17836, 1000=0.13662, 2500=0.12903 (USD); Mount: Surface Mount; Case/Package: 0402; Number of Pins: 2; Case Code (Metric): 1005; Case Code (Imperial): 0402; Core Material: Ceramic; Min Operating Temperature: -40°C; Max Operating Temperature: 125°C; Composition: Wirewound,Ceramic; Inductance: 2nH; Termination: SMD/SMT; DC Current: 1.04A; Military Standard: Not; Package Quantity: 10000; Current Rating: 1.04A; Tolerance: 5%; Packaging: Tape and Reel; Length: 1.19mm; Height: 0.66mm; Height - Seated (Max): 0.026inch; Depth: 0.64mm; Width: 0.025inch; Radiation Hardening: No; ComponentLink1URL: https://datasheet.ciiva.com:443/pdfs/VipMasterIC/IC/ABRC/ABRC-S-A0009700385/ABRC-S-A0009751294-1.pdf?src-supplier=IHS+Markit; ComponentLink1Description: https://datasheet.ciiva.com:443/pdfs/VipMasterIC/IC/ABRC/ABRC-S-A0009700385/ABRC-S-A0009751294-1.pdf?src-supplier=IHS+Markit; ComponentLink2URL: https://datasheet.ciiva.com/26928/getdatasheetpartid-762366-26928064.pdf?src-supplier=Verical; ComponentLink2Description: https://datasheet.ciiva.com/26928/getdatasheetpartid-762366-26928064.pdf?src-supplier=Verical; ComponentLink3URL: https://datasheet.ciiva.com/11140/aisc-0402-11140262.pdf?src-supplier=Avnet; ComponentLink3Description: https://datasheet.ciiva.com/11140/aisc-0402-11140262.pdf?src-supplier=Avnet; ComponentLink4URL: https://datasheet.ciiva.com/1054/aisc-0402-1054030.pdf?src-supplier=Digi-Key; ComponentLink4Description: https://datasheet.ciiva.com/1054/aisc-0402-1054030.pdf?src-supplier=Digi-Key; ComponentLink5URL: https://datasheet.ciiva.com/1054/aisc-0402-1054031.pdf?src-supplier=Digi-Key; ComponentLink5Description: https://datasheet.ciiva.com/1054/aisc-0402-1054031.pdf?src-supplier=Digi-Key; ComponentLink6URL: https://datasheet.ciiva.com/1054/aisc-0402-1054032.pdf?src-supplier=Digi-Key; ComponentLink6Description: https://datasheet.ciiva.com/1054/aisc-0402-1054032.pdf?src-supplier=Digi-Key
R1-R3 = R-0402(1005): Fixed Resistor, Metal Glaze/thick Film, 0.0625W, 10000ohm, 50V, 1% +/-Tol, 100ppm/Cel, Surface Mount, 0402; Manufacturer: Yageo; Manufacturer Part Number: AC0402FR-0710KL; Additional Feature: LASER TRIMMABLE; Rated Power Dissipation (P): 62.5mW; Rated Temperature: 70°C; Temperature Coefficient: 100ppm/°C; Package Height: 0.32mm; Package Length: 1mm; Package Width: 0.5mm; Reference Standard: AEC-Q200; Supplier 1: Digi-Key; Supplier Part Number 1: YAG3436CT-ND; RoHS: Yes; Category: Chip SMD Resistors; Stock 1: 281455; Pricing 1: 1=0.10000, 10=0.01900, 100=0.00780, 1000=0.00350, 2500=0.00304, 5000=0.00251 (USD); Mount: Surface Mount; Number of Pins: 2; Package Shape: Rectangular; Size Code: 0402; Terminal Finish: Nickel; Min Operating Temperature: -55°C; Max Operating Temperature: 155°C; Tolerance: 1%; JESD-609 Code: e3; Resistor Type: FIXED RESISTOR; Construction: Chip; Package Style: SMTMeter; Packaging: Tape and Reel; Resistance: 10kR; Technology: METAL GLAZE/THICK FILM; Termination: Wraparound; Working Voltage: 50V; ComponentLink1URL: https://datasheet.ciiva.com:443/pdfs/VipMasterIC/IC/YAGO/YAGO-S-A0003597364/YAGO-S-A0003597364-1.pdf?src-supplier=IHS+Markit; ComponentLink1Description: https://datasheet.ciiva.com:443/pdfs/VipMasterIC/IC/YAGO/YAGO-S-A0003597364/YAGO-S-A0003597364-1.pdf?src-supplier=IHS+Markit; ComponentLink2URL: https://datasheet.ciiva.com/12656/pyu-ac-51-rohs-l-2-12656634.pdf?src-supplier=Mouser; ComponentLink2Description: https://datasheet.ciiva.com/12656/pyu-ac-51-rohs-l-2-12656634.pdf?src-supplier=Mouser
R4 R5 = R-0402(1005): Fixed Resistor, Thin Film, 0.0625W, 422ohm, 50V, 0.1% +/-Tol, 25ppm/Cel, Surface Mount, 0402; Manufacturer: Yageo; Manufacturer Part Number: RT0402BRD07422RL; Power Rating: 62.5mW; Temperature Coefficient: 25ppm/°C; Supplier 1: Digi-Key; Supplier Part Number 1: YAG4263CT-ND; RoHS: Yes; Category: Chip SMD Resistors; Stock 1: 9302; Pricing 1: 1=0.39000, 10=0.27800, 100=0.11140, 1000=0.05488, 2500=0.05084, 5000=0.04600 (USD); Case/Package: 0402; Case Code (Metric): 1005; Case Code (Imperial): 0402; Min Operating Temperature: -55°C; Max Operating Temperature: 125°C; Voltage Rating: 50V; Resistance: 422R; Tolerance: 0.1%; Packaging: Tape and Reel; Termination: SMD/SMT; Voltage Rating (DC): 50V; Length: 1mm; Height: 350um; Width: 500um; Lead Free: Lead Free; ComponentLink1URL: https://datasheet.ciiva.com:443/pdfs/VipMasterIC/IC/YAGO/YAGO-S-A0008510989/YAGO-S-A0008510989-1.pdf?src-supplier=IHS+Markit; ComponentLink1Description: https://datasheet.ciiva.com:443/pdfs/VipMasterIC/IC/YAGO/YAGO-S-A0008510989/YAGO-S-A0008510989-1.pdf?src-supplier=IHS+Markit; ComponentLink2URL: https://datasheet.ciiva.com/12705/pyu-rt-1-to-0-05-rohs-l-4-12705867.pdf?src-supplier=Mouser; ComponentLink2Description: https://datasheet.ciiva.com/12705/pyu-rt-1-to-0-05-rohs-l-4-12705867.pdf?src-supplier=Mouser
U1 = NRSC-NRF52832-QF-48: Telecom Circuit, 1-Func; Manufacturer: Nordic Semiconductor; Manufacturer Part Number: NRF52832-QFAB-R; Number of Functions: 1; Supply Voltage-Nom: 3V; Supplier 1: Digi-Key; Supplier Part Number 1: 1490-1055-1-ND; RoHS: No; Category: RF Receivers, Transceivers; Stock 1: 6612; Pricing 1: 1=3.64000, 10=3.25000, 25=2.92520, 100=2.66500, 250=2.40500, 500=2.15800, 1000=1.82000 (USD); Package Code: HVQCCN; Number of Pins: 48; Package Shape: Square; Min Operating Temperature: -40°C; Max Operating Temperature: 85°C; JESD-30 Code: S-XQCC-N48; Moisture Sensitivity Level: 2; Package Style: CHIP CARRIER, HEAT SINK/SLUG, VERY THIN PROFILEMeter; Surface Mount: Yes; Telecom IC Type: TELECOM CIRCUIT; Terminal Form: No Lead; Terminal Position: QUAD; Length: 6mm; Width: 6mm; Height - Seated (Max): 0.95mm; Terminal Pitch: 0.4mm; Temperature Grade: INDUSTRIAL; ComponentLink1URL: https://datasheet.ciiva.com:443/pdfs/VipMasterIC/IC/NRSA/NRSA-S-A0002414264/NRSA-S-A0002414264-1.pdf?src-supplier=IHS+Markit; ComponentLink1Description: https://datasheet.ciiva.com:443/pdfs/VipMasterIC/IC/NRSA/NRSA-S-A0002414264/NRSA-S-A0002414264-1.pdf?src-supplier=IHS+Markit; ComponentLink2URL: http://infocenter.nordicsemi.com/pdf/nRF52832_PB_v1.7.pdf?src-supplier=Digi-Key; ComponentLink2Description: http://infocenter.nordicsemi.com/pdf/nRF52832_PB_v1.7.pdf?src-supplier=Digi-Key; ComponentLink3URL: http://infocenter.nordicsemi.com/pdf/nRF52832_PS_v1.4.pdf?src-supplier=Digi-Key; ComponentLink3Description: http://infocenter.nordicsemi.com/pdf/nRF52832_PS_v1.4.pdf?src-supplier=Digi-Key
X1 = CRYSTAL_32K768: Parallel - Fundamental Quartz Crystal, 0.032768MHz Nom; Manufacturer: ECS International; Manufacturer Part Number: ECS-.327-12.5-1210-TR; Aging: 3 PPM/FIRST YEAR; Drive Level: 0.1uW; Frequency Stability: 0.0144%; Frequency Tolerance: 20ppm; Load Capacitance: 12.5pF; Series Resistance: 90kR; Supplier 1: Digi-Key; Supplier Part Number 1: XC2282CT-ND; RoHS: No; Category: Crystals; Stock 1: 7776; Pricing 1: 1=1.38000, 10=1.32200, 50=1.29160, 100=1.10700, 500=1.07626, 1000=0.90713, 2500=0.86100 (USD); Mount: Surface Mount; Min Operating Temperature: -40°C; Max Operating Temperature: 85°C; Crystal/Resonator Type: PARALLEL - FUNDAMENTAL; Operating Frequency-Nom: 0.032768; ComponentLink1URL: https://datasheet.ciiva.com:443/pdfs/VipMasterIC/IC/ECSI/ECSI-S-A0009254912/ECSI-S-A0009254912-1.pdf?src-supplier=IHS+Markit; ComponentLink1Description: https://datasheet.ciiva.com:443/pdfs/VipMasterIC/IC/ECSI/ECSI-S-A0009254912/ECSI-S-A0009254912-1.pdf?src-supplier=IHS+Markit; ComponentLink2URL: https://www.ecsxtal.com/store/pdf/ECX-1210.pdf?src-supplier=Digi-Key; ComponentLink2Description: https://www.ecsxtal.com/store/pdf/ECX-1210.pdf?src-supplier=Digi-Key
X2 = CRYSTAL_32MHz: Parallel - Fundamental Quartz Crystal, 32MHz Nom; Manufacturer: Diodes; Manufacturer Part Number: US3200005Z; Load Capacitance: 8pF; ESR (Equivalent Series Resistance): 80R; Frequency Stability: 10ppm; Supplier 1: Digi-Key; Supplier Part Number 1: US3200005ZCT-ND; RoHS: Yes; Category: Crystals; Pricing 1: 1=1.45000, 10=1.38400, 50=1.35200, 100=1.15880, 500=1.12666, 1000=0.94961 (USD); Mount: Surface Mount; Case/Package: SMD/SMT; Min Operating Temperature: -20°C; Max Operating Temperature: 70°C; Packaging: Tape and Reel; Frequency: 32MHz; Frequency Tolerance: 10ppm; Length: 0.063inch; Height: 0.014inch; Width: 0.047inch; ComponentLink1URL: https://datasheet.ciiva.com:443/pdfs/VipMasterIC/IC/DIOD/DIOD-S-A0002236499/DIOD-S-A0002236499-1.pdf?src-supplier=IHS+Markit; ComponentLink1Description: https://datasheet.ciiva.com:443/pdfs/VipMasterIC/IC/DIOD/DIOD-S-A0002236499/DIOD-S-A0002236499-1.pdf?src-supplier=IHS+Markit; ComponentLink2URL: https://media.digikey.com/pdf/Data%20Sheets/Pericom%20PDFs/US3200005Z_Ver.A.pdf?src-supplier=Digi-Key; ComponentLink2Description: https://media.digikey.com/pdf/Data%20Sheets/Pericom%20PDFs/US3200005Z_Ver.A.pdf?src-supplier=Digi-Key